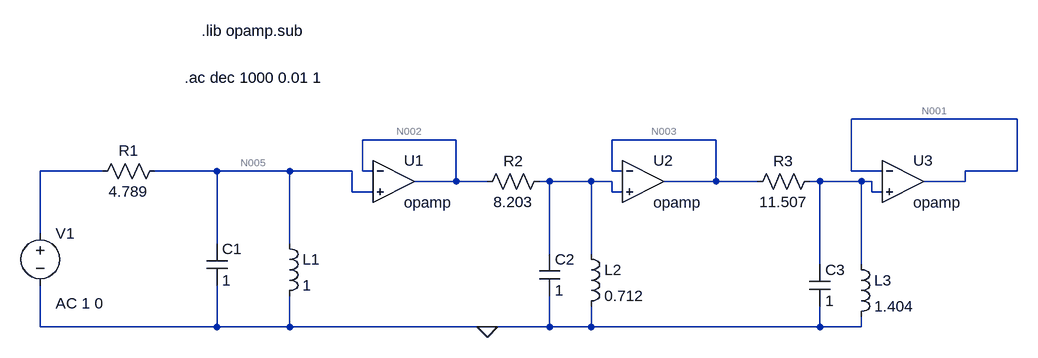
[diagram p0: schematic Draft1.asc]
Draft1.asc, the LTspice schematic file:
Version 4
SHEET 1 1012 680
WIRE 1008 48 752 48
WIRE 144 80 0 80
WIRE 544 80 384 80
WIRE -400 128 -496 128
WIRE -224 128 -320 128
WIRE -112 128 -224 128
WIRE -16 128 -112 128
WIRE 0 128 0 80
WIRE 16 128 0 128
WIRE 384 128 384 80
WIRE 400 128 384 128
WIRE 752 128 752 48
WIRE 800 128 752 128
WIRE 1008 128 1008 48
WIRE 1008 128 928 128
WIRE 144 144 144 80
WIRE 144 144 80 144
WIRE 192 144 144 144
WIRE 288 144 272 144
WIRE 352 144 288 144
WIRE 384 144 352 144
WIRE 544 144 544 80
WIRE 544 144 464 144
WIRE 608 144 544 144
WIRE 704 144 688 144
WIRE 768 144 704 144
WIRE 784 144 768 144
WIRE 928 144 928 128
WIRE 928 144 864 144
WIRE -16 160 -16 128
WIRE 16 160 -16 160
WIRE 384 160 384 144
WIRE 400 160 384 160
WIRE 784 160 784 144
WIRE 800 160 784 160
WIRE -496 224 -496 128
WIRE -224 240 -224 128
WIRE -112 240 -112 128
WIRE 288 256 288 144
WIRE 352 256 352 144
WIRE 704 272 704 144
WIRE 768 272 768 144
WIRE -496 368 -496 304
WIRE -224 368 -224 304
WIRE -224 368 -496 368
WIRE -112 368 -112 320
WIRE -112 368 -224 368
WIRE 192 368 -112 368
WIRE 288 368 288 320
WIRE 288 368 192 368
WIRE 352 368 352 336
WIRE 352 368 288 368
WIRE 704 368 704 336
WIRE 704 368 352 368
WIRE 768 368 768 352
WIRE 768 368 704 368
FLAG 192 368 0
SYMBOL OpAmps\\opamp 48 80 R0
SYMATTR InstName U1
SYMBOL OpAmps\\opamp 432 80 R0
SYMATTR InstName U2
SYMBOL OpAmps\\opamp 832 80 R0
SYMATTR InstName U3
SYMBOL res -304 112 R90
WINDOW 0 0 56 VBottom 2
WINDOW 3 32 56 VTop 2
SYMATTR InstName R1
SYMATTR Value 4.789
SYMBOL res 288 128 R90
WINDOW 0 0 56 VBottom 2
WINDOW 3 32 56 VTop 2
SYMATTR InstName R2
SYMATTR Value 8.203
SYMBOL res 704 128 R90
WINDOW 0 0 56 VBottom 2
WINDOW 3 32 56 VTop 2
SYMATTR InstName R3
SYMATTR Value 11.507
SYMBOL cap -240 240 R0
SYMATTR InstName C1
SYMATTR Value 1
SYMBOL cap 272 256 R0
SYMATTR InstName C2
SYMATTR Value 1
SYMBOL cap 688 272 R0
SYMATTR InstName C3
SYMATTR Value 1
SYMBOL ind -128 224 R0
SYMATTR InstName L1
SYMATTR Value 1
SYMBOL ind 336 240 R0
SYMATTR InstName L2
SYMATTR Value 0.712
SYMBOL ind 752 256 R0
SYMATTR InstName L3
SYMATTR Value 1.404
SYMBOL voltage -496 208 R0
WINDOW 123 24 124 Left 2
WINDOW 39 0 0 Left 0
SYMATTR InstName V1
SYMATTR Value ""
SYMATTR Value2 AC 1 0
TEXT -248 -88 Left 2 !.lib opamp.sub
TEXT -274 -16 Left 2 !.ac dec 1000 0.01 1

The netlist it stands for:
* Draft1.asc
XU1 N002 N005 N002 opamp Aol=100K GBW=10Meg  ; pins invin noninvin out
XU2 N003 N006 N003 opamp Aol=100K GBW=10Meg  ; pins invin noninvin out
XU3 N001 N007 N001 opamp Aol=100K GBW=10Meg  ; pins invin noninvin out
R1 N005 N004 4.789
R2 N006 N002 8.203
R3 N007 N003 11.507
C1 N005 0 1
C2 N006 0 1
C3 N007 0 1
L1 N005 0 1
L2 N006 0 0.712
L3 N007 0 1.404
V1 N004 0 AC 1 0
.lib opamp.sub
.ac dec 1000 0.01 1
.backanno
.end

* Results of the author's LTspice run, read from the files saved beside the schematic
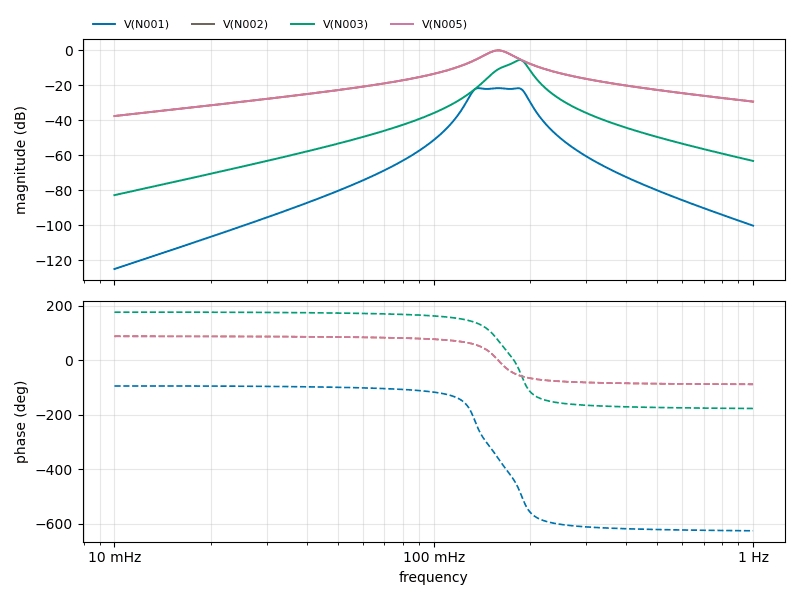
[diagram p1: AC Analysis of Draft1.asc, plotted from the saved traces]
* AC Analysis, 1 run:
*   V(N001): -125.11 dB at 10 mHz, -100.31 dB at 1 Hz, peak -21.63 dB at 159.2 mHz, 3 dB below the peak at 131.2 mHz and 193.1 mHz
*   V(N002): -37.61 dB at 10 mHz, -29.35 dB at 1 Hz, peak -0.04 dB at 159.2 mHz, 3 dB below the peak at 143.3 mHz and 176.7 mHz
*   V(N003): -82.85 dB at 10 mHz, -63.28 dB at 1 Hz, peak -5.53 dB at 186.2 mHz, 3 dB below the peak at 170.3 mHz and 195.2 mHz
*   V(N005): -37.61 dB at 10 mHz, -29.35 dB at 1 Hz, peak -0.04 dB at 159.2 mHz, 3 dB below the peak at 143.3 mHz and 176.7 mHz